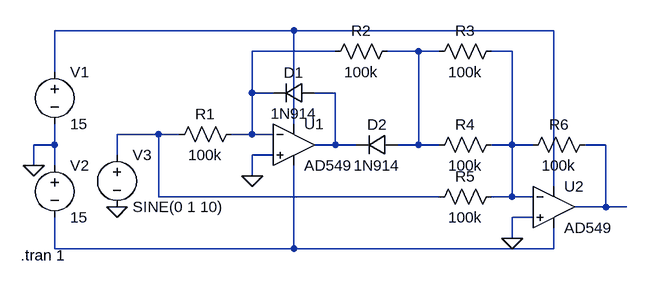
[diagram p0: schematic Absolute.asc]
Absolute.asc, the LTspice schematic file:
Version 4
SHEET 1 880 680
WIRE 96 -16 -272 -16
WIRE 496 -16 96 -16
WIRE 160 16 32 16
WIRE 288 16 240 16
WIRE 320 16 288 16
WIRE 432 16 400 16
WIRE -272 48 -272 -16
WIRE 32 80 32 16
WIRE 64 80 32 80
WIRE 160 80 128 80
WIRE 96 128 96 -16
WIRE -112 144 -176 144
WIRE -80 144 -112 144
WIRE 32 144 32 80
WIRE 32 144 0 144
WIRE 64 144 32 144
WIRE -272 160 -272 128
WIRE -272 160 -304 160
WIRE 160 160 160 80
WIRE 160 160 128 160
WIRE 192 160 160 160
WIRE 288 160 288 16
WIRE 288 160 256 160
WIRE 320 160 288 160
WIRE 432 160 432 16
WIRE 432 160 400 160
WIRE 464 160 432 160
WIRE 576 160 544 160
WIRE -176 176 -176 144
WIRE 64 176 32 176
WIRE -304 192 -304 160
WIRE -272 192 -272 160
WIRE 32 208 32 176
WIRE 496 224 496 -16
WIRE -112 240 -112 144
WIRE 320 240 -112 240
WIRE 432 240 432 160
WIRE 432 240 400 240
WIRE 464 240 432 240
WIRE 576 256 576 160
WIRE 576 256 528 256
WIRE 608 256 576 256
WIRE 464 272 432 272
WIRE 432 304 432 272
WIRE -272 320 -272 272
WIRE 96 320 96 192
WIRE 96 320 -272 320
WIRE 496 320 496 288
WIRE 496 320 96 320
FLAG 32 208 0
FLAG 432 304 0
FLAG -304 192 0
FLAG -176 256 0
SYMBOL Opamps\\AD549 96 96 R0
SYMATTR InstName U1
SYMBOL Opamps\\AD549 496 192 R0
SYMATTR InstName U2
SYMBOL diode 128 64 R90
WINDOW 0 0 32 VBottom 2
WINDOW 3 32 32 VTop 2
SYMATTR InstName D1
SYMATTR Value 1N914
SYMBOL diode 256 144 R90
WINDOW 0 0 32 VBottom 2
WINDOW 3 32 32 VTop 2
SYMATTR InstName D2
SYMATTR Value 1N914
SYMBOL res 16 128 R90
WINDOW 0 0 56 VBottom 2
WINDOW 3 32 56 VTop 2
SYMATTR InstName R1
SYMATTR Value 100k
SYMBOL res 256 0 R90
WINDOW 0 0 56 VBottom 2
WINDOW 3 32 56 VTop 2
SYMATTR InstName R2
SYMATTR Value 100k
SYMBOL res 416 0 R90
WINDOW 0 0 56 VBottom 2
WINDOW 3 32 56 VTop 2
SYMATTR InstName R3
SYMATTR Value 100k
SYMBOL res 416 144 R90
WINDOW 0 0 56 VBottom 2
WINDOW 3 32 56 VTop 2
SYMATTR InstName R4
SYMATTR Value 100k
SYMBOL res 416 224 R90
WINDOW 0 0 56 VBottom 2
WINDOW 3 32 56 VTop 2
SYMATTR InstName R5
SYMATTR Value 100k
SYMBOL res 560 144 R90
WINDOW 0 0 56 VBottom 2
WINDOW 3 32 56 VTop 2
SYMATTR InstName R6
SYMATTR Value 100k
SYMBOL voltage -272 32 R0
WINDOW 123 0 0 Left 0
WINDOW 39 0 0 Left 0
SYMATTR InstName V1
SYMATTR Value 15
SYMBOL voltage -272 176 R0
WINDOW 123 0 0 Left 0
WINDOW 39 0 0 Left 0
SYMATTR InstName V2
SYMATTR Value 15
SYMBOL voltage -176 160 R0
WINDOW 123 0 0 Left 0
WINDOW 39 0 0 Left 0
SYMATTR InstName V3
SYMATTR Value SINE(0 1 10)
TEXT -324 330 Left 2 !.tran 1

The netlist it stands for:
* Absolute.asc
XU1 0 N002 N001 N008 N005 AD549  ; pins In+ In- V+ V- OUT
XU2 0 N004 N001 N008 N007 AD549  ; pins In+ In- V+ V- OUT
D1 N005 N002 1N914
D2 N003 N005 1N914
R1 N002 N006 100k
R2 N003 N002 100k
R3 N004 N003 100k
R4 N004 N003 100k
R5 N004 N006 100k
R6 N007 N004 100k
V1 N001 0 15
V2 0 N008 15
V3 N006 0 SINE(0 1 10)
.model D D
.lib standard.dio
.tran 1
.backanno
.end